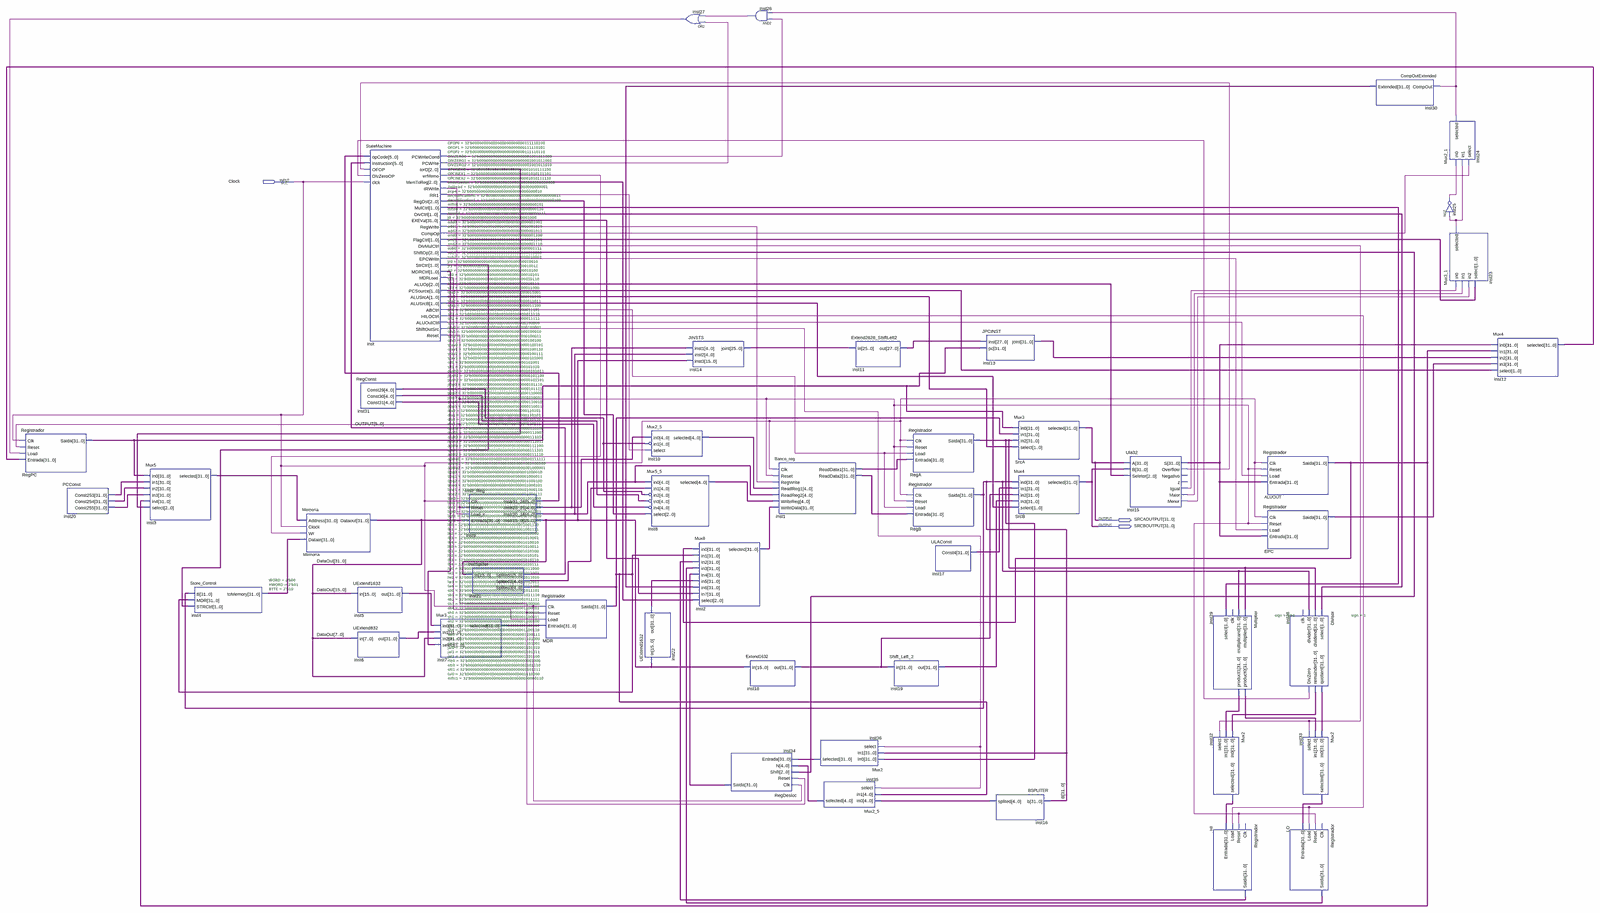
[diagram p0: schematic sheet, whole]
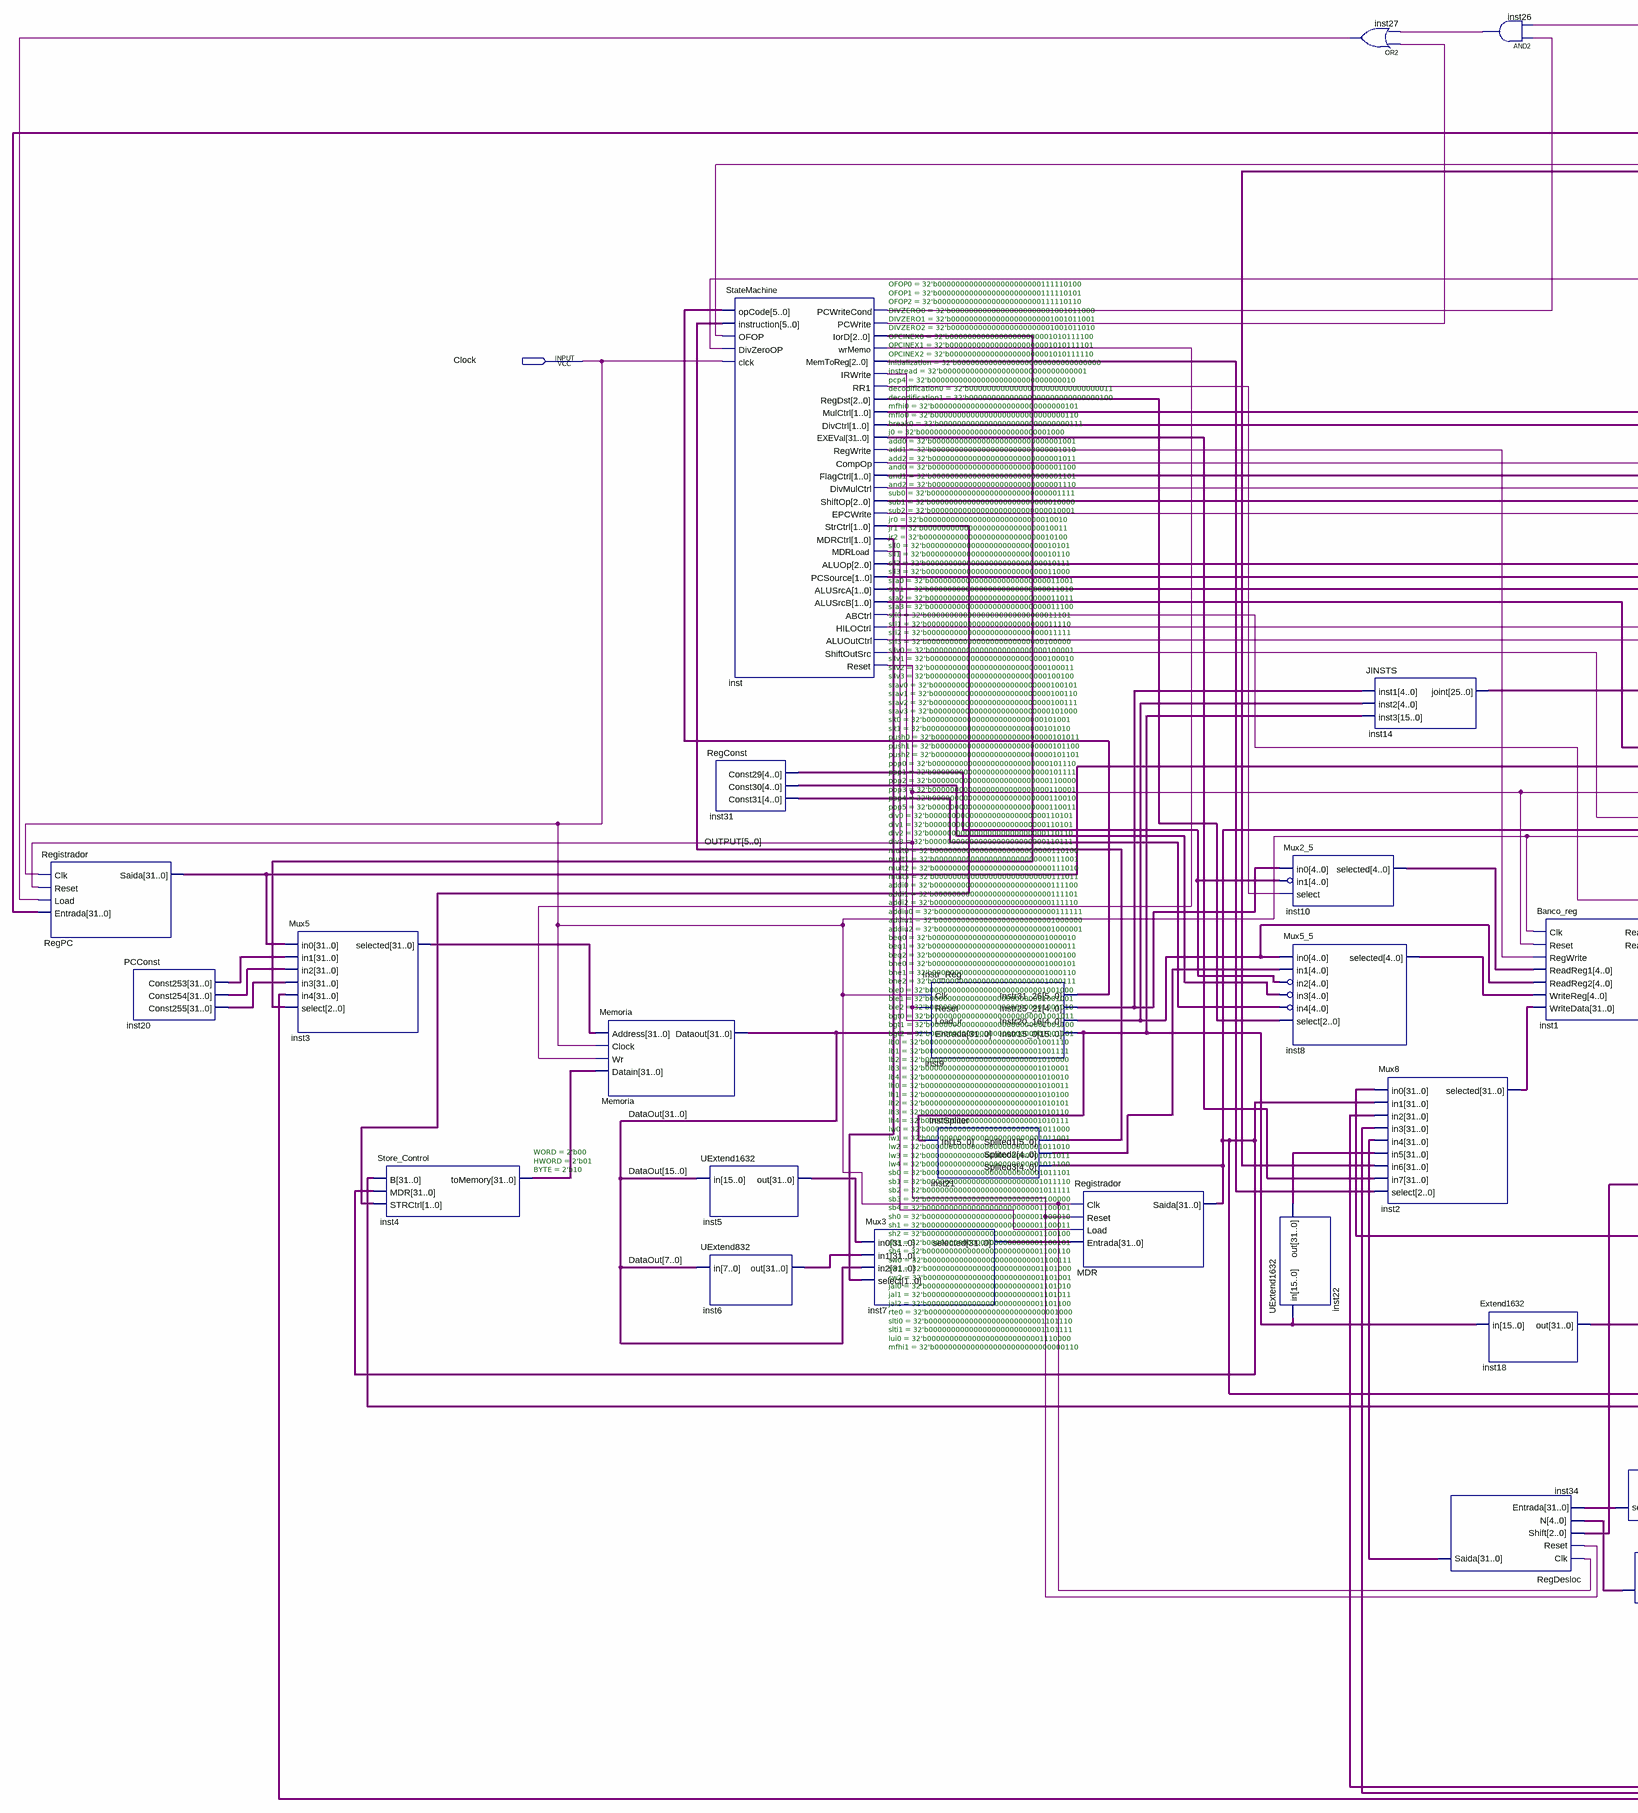
[diagram p1: schematic sheet, left part]
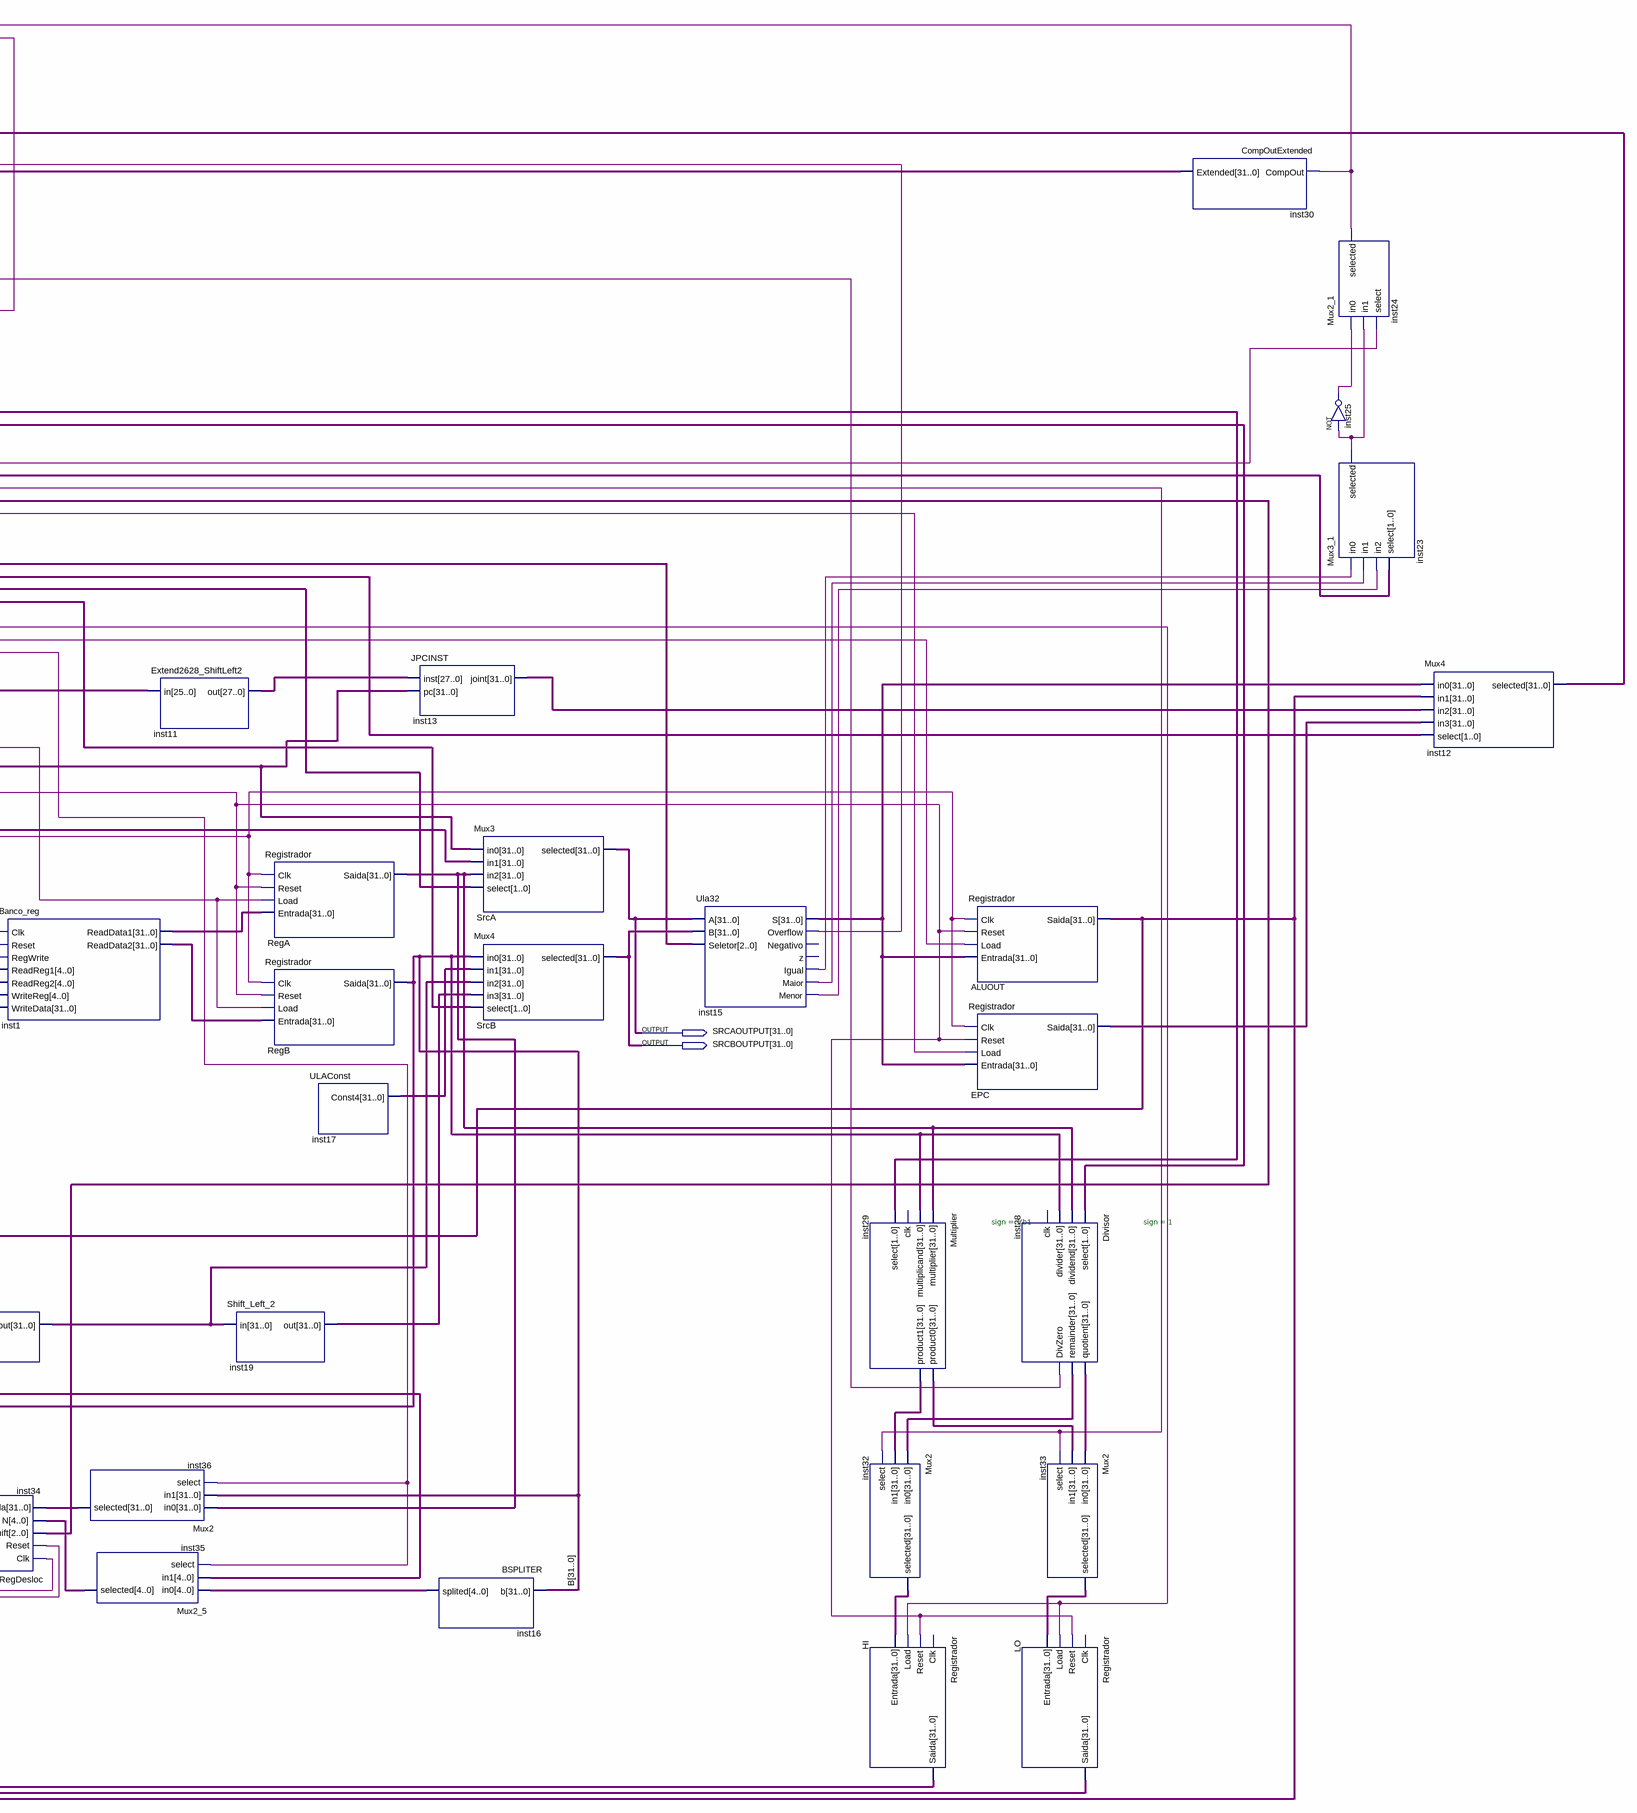
[diagram p2: schematic sheet, right part]
// Quartus schematic Schematic.bdf as structural Verilog: 48 symbols, 3 pins
module Schematic (
  input  Clock,
  output [31:0] SRCAOUTPUT,
  output [31:0] SRCBOUTPUT
);

  wire inst15_igual, inst15_maior, inst15_menor, inst15_overflow, inst23_selected, inst24_selected,
       inst25_out, inst26_out, inst27_out, inst28_divzero, inst_abctrl, inst_aluoutctrl, inst_compop,
       inst_divmulctrl, inst_epcwrite, inst_hiloctrl, inst_irwrite, inst_mdrload, inst_pcwrite,
       inst_pcwritecond, inst_regwrite, inst_reset, inst_rr1, inst_shiftoutsrc, inst_wrmemo;
  wire [1:0] inst_alusrca, inst_alusrcb, inst_divctrl, inst_flagctrl, inst_mdrctrl, inst_mulctrl,
       inst_pcsource, inst_strctrl;
  wire [2:0] inst_aluop, inst_iord, inst_memtoreg, inst_regdst, inst_shiftop;
  wire [4:0] inst8_selected, inst9_instr20_16, inst9_instr25_21, inst10_selected, inst16_splited,
       inst21_splited2, inst31_const29, inst31_const30, inst31_const31, inst35_selected;
  wire [5:0] inst9_instr31_26, OUTPUT;
  wire [15:0] inst9_instr15_0;
  wire [25:0] inst14_joint;
  wire [27:0] inst11_out;
  wire [31:0] ALUOUT_saida, B, DataOut, EPC_saida, HI_saida, inst1_readdata1, inst1_readdata2,
       inst2_selected, inst3_selected, inst4_tomemory, inst5_out, inst6_out, inst7_selected, inst12_selected,
       inst13_joint, inst15_s, inst17_const4, inst18_out, inst19_out, inst20_const253, inst20_const254,
       inst20_const255, inst21_splited3, inst22_out, inst28_quotient, inst28_remainder, inst29_product0,
       inst29_product1, inst30_extended, inst32_selected, inst33_selected, inst34_saida, inst36_selected,
       inst_exeval, LO_saida, RegA_saida, RegPC_saida;

  Registrador RegPC (
    .Clk(Clock), .Reset(inst_reset), .Load(inst27_out), .Entrada(inst12_selected), .Saida(RegPC_saida));
  PCConst inst20 (.Const253(inst20_const253), .Const254(inst20_const254), .Const255(inst20_const255));
  Mux5 inst3 (
    .in0(RegPC_saida), .in1(inst20_const253), .in2(inst20_const254), .in3(inst20_const255),
    .in4(ALUOUT_saida), .select(inst_iord), .selected(inst3_selected));
  Store_Control #(.WORD(2'b00), .HWORD(2'b01), .BYTE(2'b10)) inst4 (
    .B(B), .MDR(inst21_splited3), .STRCtrl(inst_strctrl), .toMemory(inst4_tomemory));
  Memoria Memoria (
    .Address(inst3_selected), .Clock(Clock), .Wr(inst_wrmemo), .Datain(inst4_tomemory), .Dataout(DataOut));
  UExtend1632 inst5 (.in(DataOut[15:0]), .out(inst5_out));
  UExtend832 inst6 (.in(DataOut[7:0]), .out(inst6_out));
  StateMachine #(.OFOP0(32'b00000000000000000000000111110100), .OFOP1(32'b00000000000000000000000111110101), .OFOP2(32'b00000000000000000000000111110110), .DIVZERO0(32'b00000000000000000000001001011000), .DIVZERO1(32'b00000000000000000000001001011001), .DIVZERO2(32'b00000000000000000000001001011010), .OPCINEX0(32'b00000000000000000000001010111100), .OPCINEX1(32'b00000000000000000000001010111101), .OPCINEX2(32'b00000000000000000000001010111110), .initialization(32'b00000000000000000000000000000000), .instread(32'b00000000000000000000000000000001), .pcp4(32'b00000000000000000000000000000010), .decodification0(32'b00000000000000000000000000000011), .decodification1(32'b00000000000000000000000000000100), .mfhi0(32'b00000000000000000000000000000101), .mflo0(32'b00000000000000000000000000000110), .break0(32'b00000000000000000000000000000111), .j0(32'b00000000000000000000000000001000), .add0(32'b00000000000000000000000000001001), .add1(32'b00000000000000000000000000001010), .add2(32'b00000000000000000000000000001011), .and0(32'b00000000000000000000000000001100), .and1(32'b00000000000000000000000000001101), .and2(32'b00000000000000000000000000001110), .sub0(32'b00000000000000000000000000001111), .sub1(32'b00000000000000000000000000010000), .sub2(32'b00000000000000000000000000010001), .jr0(32'b00000000000000000000000000010010), .jr1(32'b00000000000000000000000000010011), .jr2(32'b00000000000000000000000000010100), .sll0(32'b00000000000000000000000000010101), .sll1(32'b00000000000000000000000000010110), .sll2(32'b00000000000000000000000000010111), .sll3(32'b00000000000000000000000000011000), .sra0(32'b00000000000000000000000000011001), .sra1(32'b00000000000000000000000000011010), .sra2(32'b00000000000000000000000000011011), .sra3(32'b00000000000000000000000000011100), .srl0(32'b00000000000000000000000000011101), .srl1(32'b00000000000000000000000000011110), .srl2(32'b00000000000000000000000000011111), .srl3(32'b00000000000000000000000000100000), .sllv0(32'b00000000000000000000000000100001), .sllv1(32'b00000000000000000000000000100010), .sllv2(32'b00000000000000000000000000100011), .sllv3(32'b00000000000000000000000000100100), .srav0(32'b00000000000000000000000000100101), .srav1(32'b00000000000000000000000000100110), .srav2(32'b00000000000000000000000000100111), .srav3(32'b00000000000000000000000000101000), .slt0(32'b00000000000000000000000000101001), .slt1(32'b00000000000000000000000000101010), .push0(32'b00000000000000000000000000101011), .push1(32'b00000000000000000000000000101100), .push2(32'b00000000000000000000000000101101), .pop0(32'b00000000000000000000000000101110), .pop1(32'b00000000000000000000000000101111), .pop2(32'b00000000000000000000000000110000), .pop3(32'b00000000000000000000000000110001), .pop4(32'b00000000000000000000000000110010), .pop5(32'b00000000000000000000000000110011), .div0(32'b00000000000000000000000000110101), .div1(32'b00000000000000000000000000110101), .div2(32'b00000000000000000000000000110110), .div3(32'b00000000000000000000000000110111), .mult0(32'b00000000000000000000000000110100), .mult1(32'b00000000000000000000000000111001), .mult2(32'b00000000000000000000000000111010), .mult3(32'b00000000000000000000000000111011), .addi0(32'b00000000000000000000000000111100), .addi1(32'b00000000000000000000000000111101), .addi2(32'b00000000000000000000000000111110), .addiu0(32'b00000000000000000000000000111111), .addiu1(32'b00000000000000000000000001000000), .addiu2(32'b00000000000000000000000001000001), .beq0(32'b00000000000000000000000001000010), .beq1(32'b00000000000000000000000001000011), .beq2(32'b00000000000000000000000001000100), .bne0(32'b00000000000000000000000001000101), .bne1(32'b00000000000000000000000001000110), .bne2(32'b00000000000000000000000001000111), .ble0(32'b00000000000000000000000001001000), .ble1(32'b00000000000000000000000001001001), .ble2(32'b00000000000000000000000001001010), .bgt0(32'b00000000000000000000000001001011), .bgt1(32'b00000000000000000000000001001100), .bgt2(32'b00000000000000000000000001001101), .lb0(32'b00000000000000000000000001001110), .lb1(32'b00000000000000000000000001001111), .lb2(32'b00000000000000000000000001010000), .lb3(32'b00000000000000000000000001010001), .lb4(32'b00000000000000000000000001010010), .lh0(32'b00000000000000000000000001010011), .lh1(32'b00000000000000000000000001010100), .lh2(32'b00000000000000000000000001010101), .lh3(32'b00000000000000000000000001010110), .lh4(32'b00000000000000000000000001010111), .lw0(32'b00000000000000000000000001011000), .lw1(32'b00000000000000000000000001011001), .lw2(32'b00000000000000000000000001011010), .lw3(32'b00000000000000000000000001011011), .lw4(32'b00000000000000000000000001011100), .sb0(32'b00000000000000000000000001011101), .sb1(32'b00000000000000000000000001011110), .sb2(32'b00000000000000000000000001011111), .sb3(32'b00000000000000000000000001100000), .sb4(32'b00000000000000000000000001100001), .sh0(32'b00000000000000000000000001100010), .sh1(32'b00000000000000000000000001100011), .sh2(32'b00000000000000000000000001100100), .sh3(32'b00000000000000000000000001100101), .sh4(32'b00000000000000000000000001100110), .sw0(32'b00000000000000000000000001100111), .sw1(32'b00000000000000000000000001101000), .sw2(32'b00000000000000000000000001101001), .jal0(32'b00000000000000000000000001101010), .jal1(32'b00000000000000000000000001101011), .jal2(32'b00000000000000000000000001101100), .rte0(32'b00000000000000000000000000001000), .slti0(32'b00000000000000000000000001101110), .slti1(32'b00000000000000000000000001101111), .lui0(32'b00000000000000000000000001110000), .mfhi1(32'b00000000000000000000000000000110)) inst (
    .opCode(inst9_instr31_26), .instruction(OUTPUT), .OFOP(inst15_overflow), .DivZeroOP(inst28_divzero),
    .clck(Clock), .PCWriteCond(inst_pcwritecond), .PCWrite(inst_pcwrite), .IorD(inst_iord),
    .wrMemo(inst_wrmemo), .MemToReg(inst_memtoreg), .IRWrite(inst_irwrite), .RR1(inst_rr1),
    .RegDst(inst_regdst), .MulCtrl(inst_mulctrl), .DivCtrl(inst_divctrl), .EXEVal(inst_exeval),
    .RegWrite(inst_regwrite), .CompOp(inst_compop), .FlagCtrl(inst_flagctrl), .DivMulCtrl(inst_divmulctrl),
    .ShiftOp(inst_shiftop), .EPCWrite(inst_epcwrite), .StrCtrl(inst_strctrl), .MDRCtrl(inst_mdrctrl),
    .MDRLoad(inst_mdrload), .ALUOp(inst_aluop), .PCSource(inst_pcsource), .ALUSrcA(inst_alusrca),
    .ALUSrcB(inst_alusrcb), .ABCtrl(inst_abctrl), .HILOCtrl(inst_hiloctrl), .ALUOutCtrl(inst_aluoutctrl),
    .ShiftOutSrc(inst_shiftoutsrc), .Reset(inst_reset));
  RegConst inst31 (.Const29(inst31_const29), .Const30(inst31_const30), .Const31(inst31_const31));
  Mux3 inst7 (.in0(inst5_out), .in1(inst6_out), .in2(DataOut), .select(inst_mdrctrl), .selected(inst7_selected));
  Instr_Reg inst9 (
    .Clk(Clock), .Reset(inst_reset), .Load_ir(inst_irwrite), .Entrada(DataOut),
    .Instr31_26(inst9_instr31_26), .Instr25_21(inst9_instr25_21), .Instr20_16(inst9_instr20_16),
    .Instr15_0(inst9_instr15_0));
  InstSpliter inst21 (.In(inst9_instr15_0), .Splited1(OUTPUT), .Splited2(inst21_splited2), .Splited3(inst21_splited3));
  Registrador MDR (
    .Clk(Clock), .Reset(inst_reset), .Load(inst_mdrload), .Entrada(inst7_selected), .Saida(inst21_splited3));
  Mux2_5 inst10 (.in0(inst9_instr25_21), .in1(inst31_const29 ^ 5'h1d), .select(inst_rr1), .selected(inst10_selected));
  Mux5_5 inst8 (
    .in0(inst9_instr20_16), .in1(inst21_splited2), .in2(inst31_const29 ^ 5'h1d),
    .in3(inst31_const30 ^ 5'h1e), .in4(~inst31_const31), .select(inst_regdst), .selected(inst8_selected));
  UExtend1632 inst22 (.in(inst9_instr15_0), .out(inst22_out));
  or inst27 (inst27_out, inst_pcwrite, inst26_out);
  JINSTS inst14 (.inst1(inst9_instr25_21), .inst2(inst9_instr20_16), .inst3(inst9_instr15_0), .joint(inst14_joint));
  Mux8 inst2 (
    .in0(ALUOUT_saida), .in1(inst21_splited3), .in2(HI_saida), .in3(LO_saida), .in4(inst34_saida),
    .in5(inst22_out), .in6(inst30_extended), .in7(inst_exeval), .select(inst_memtoreg),
    .selected(inst2_selected));
  RegDesloc inst34 (
    .Clk(Clock), .Reset(inst_reset), .Shift(inst_shiftop), .N(inst35_selected), .Entrada(inst36_selected),
    .Saida(inst34_saida));
  and inst26 (inst26_out, inst_pcwritecond, inst24_selected);
  Extend1632 inst18 (.in(inst9_instr15_0), .out(inst18_out));
  Banco_reg inst1 (
    .Clk(Clock), .Reset(inst_reset), .RegWrite(inst_regwrite), .ReadReg1(inst10_selected),
    .ReadReg2(inst9_instr20_16), .WriteReg(inst8_selected), .WriteData(inst2_selected),
    .ReadData1(inst1_readdata1), .ReadData2(inst1_readdata2));
  Mux2 inst36 (.in0(RegA_saida), .in1(B), .select(inst_shiftoutsrc), .selected(inst36_selected));
  Mux2_5 inst35 (.in0(inst16_splited), .in1(inst21_splited3), .select(inst_shiftoutsrc), .selected(inst35_selected));
  Extend2628_ShiftLeft2 inst11 (.in(inst14_joint), .out(inst11_out));
  Shift_Left_2 inst19 (.in(inst18_out), .out(inst19_out));
  Registrador RegA (.Clk(Clock), .Reset(inst_reset), .Load(inst_abctrl), .Entrada(inst1_readdata1), .Saida(RegA_saida));
  Registrador RegB (.Clk(Clock), .Reset(inst_reset), .Load(inst_abctrl), .Entrada(inst1_readdata2), .Saida(B));
  ULAConst inst17 (.Const4(inst17_const4));
  JPCINST inst13 (.inst(inst11_out), .pc(RegPC_saida), .joint(inst13_joint));
  BSPLITER inst16 (.b(B), .splited(inst16_splited));
  Mux3 SrcA (.in0(RegPC_saida), .in1(inst21_splited3), .in2(RegA_saida), .select(inst_alusrca), .selected(SRCAOUTPUT));
  Mux4 SrcB (
    .in0(B), .in1(inst17_const4), .in2(inst18_out), .in3(inst19_out), .select(inst_alusrcb),
    .selected(SRCBOUTPUT));
  Ula32 inst15 (
    .A(SRCAOUTPUT), .B(SRCBOUTPUT), .Seletor(inst_aluop), .S(inst15_s), .Overflow(inst15_overflow),
    .Igual(inst15_igual), .Maior(inst15_maior), .Menor(inst15_menor));  // open: Negativo, z
  Multiplier #(.sign(1'b1)) inst29 (
    .multiplier(RegA_saida), .multiplicand(B), .select(inst_mulctrl), .product0(inst29_product0),
    .product1(inst29_product1));  // open: clk
  Mux2 inst32 (.in0(inst28_remainder), .in1(inst29_product1), .select(inst_divmulctrl), .selected(inst32_selected));
  Registrador HI (.Reset(inst_reset), .Load(inst_hiloctrl), .Entrada(inst32_selected), .Saida(HI_saida));  // open: Clk
  Registrador ALUOUT (
    .Clk(Clock), .Reset(inst_reset), .Load(inst_aluoutctrl), .Entrada(inst15_s), .Saida(ALUOUT_saida));
  Registrador EPC (.Clk(Clock), .Reset(inst_reset), .Load(inst_epcwrite), .Entrada(inst15_s), .Saida(EPC_saida));
  Divisor #(.sign(1)) inst28 (
    .select(inst_divctrl), .dividend(RegA_saida), .divider(B), .quotient(inst28_quotient),
    .remainder(inst28_remainder), .DivZero(inst28_divzero));  // open: clk
  Mux2 inst33 (.in0(inst28_quotient), .in1(inst29_product0), .select(inst_divmulctrl), .selected(inst33_selected));
  Registrador LO (.Reset(inst_reset), .Load(inst_hiloctrl), .Entrada(inst33_selected), .Saida(LO_saida));  // open: Clk
  CompOutExtended inst30 (.CompOut(inst24_selected), .Extended(inst30_extended));
  Mux2_1 inst24 (.in0(inst25_out), .in1(inst23_selected), .select(inst_compop), .selected(inst24_selected));
  not inst25 (inst25_out, inst23_selected);
  Mux3_1 inst23 (
    .in0(inst15_igual), .in1(inst15_maior), .in2(inst15_menor), .select(inst_flagctrl),
    .selected(inst23_selected));
  Mux4 inst12 (
    .in0(inst15_s), .in1(ALUOUT_saida), .in2(inst13_joint), .in3(EPC_saida), .select(inst_pcsource),
    .selected(inst12_selected));
endmodule
